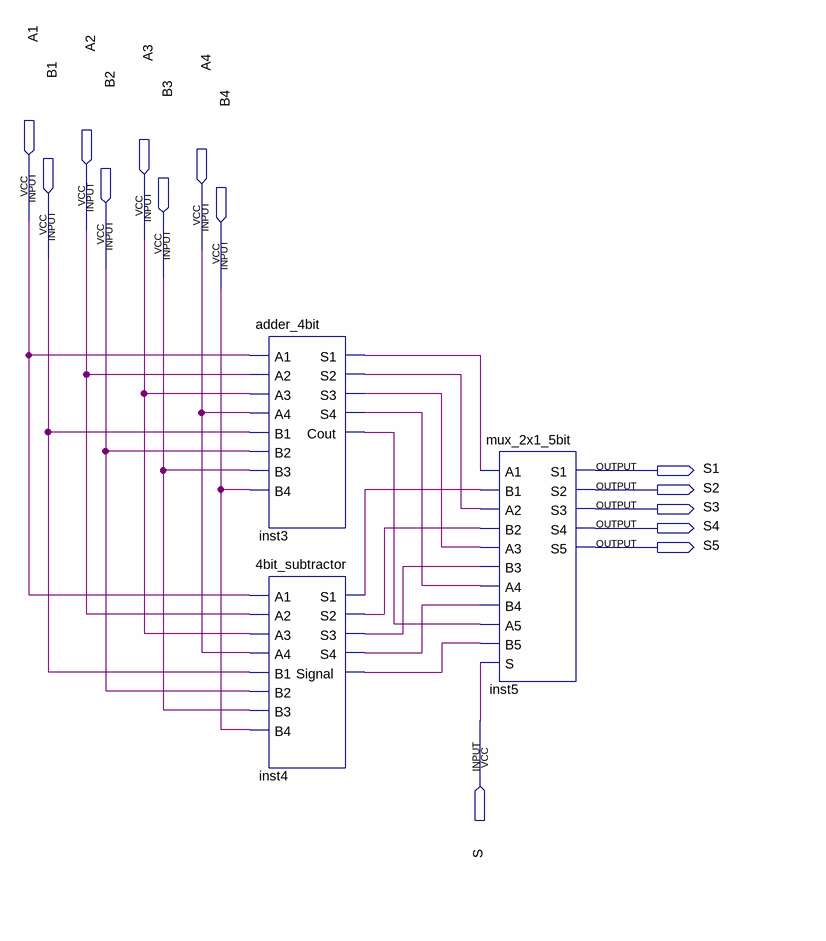
[diagram p0: schematic sheet]
// Quartus schematic arithmetic_logic_unit.bdf as structural Verilog: 3 symbols, 14 pins
module arithmetic_logic_unit (
  input  A1,
  input  A2,
  input  A3,
  input  A4,
  input  B1,
  input  B2,
  input  B3,
  input  B4,
  input  S,
  output S1,
  output S2,
  output S3,
  output S4,
  output S5
);

  wire inst3_cout, inst3_s1, inst3_s2, inst3_s3, inst3_s4, inst4_s1, inst4_s2, inst4_s3, inst4_s4,
       inst4_signal;

  adder_4bit inst3 (
    .A1(A1), .A2(A2), .A3(A3), .A4(A4), .B1(B1), .B2(B2), .B3(B3), .B4(B4), .S1(inst3_s1), .S2(inst3_s2),
    .S3(inst3_s3), .S4(inst3_s4), .Cout(inst3_cout));
  \4bit_subtractor  inst4 (
    .A1(A1), .A2(A2), .A3(A3), .A4(A4), .B1(B1), .B2(B2), .B3(B3), .B4(B4), .S1(inst4_s1), .S2(inst4_s2),
    .S3(inst4_s3), .S4(inst4_s4), .Signal(inst4_signal));
  mux_2x1_5bit inst5 (
    .A1(inst3_s1), .B1(inst4_s1), .A2(inst3_s2), .B2(inst4_s2), .A3(inst3_s3), .B3(inst4_s3), .A4(inst3_s4),
    .B4(inst4_s4), .A5(inst3_cout), .B5(inst4_signal), .S(S), .S1(S1), .S2(S2), .S3(S3), .S4(S4), .S5(S5));
endmodule
